# Altium schematic sheet P02_BLOCK DIAGRAM_POWER TREE.SchDoc
size 420 x 297 mm
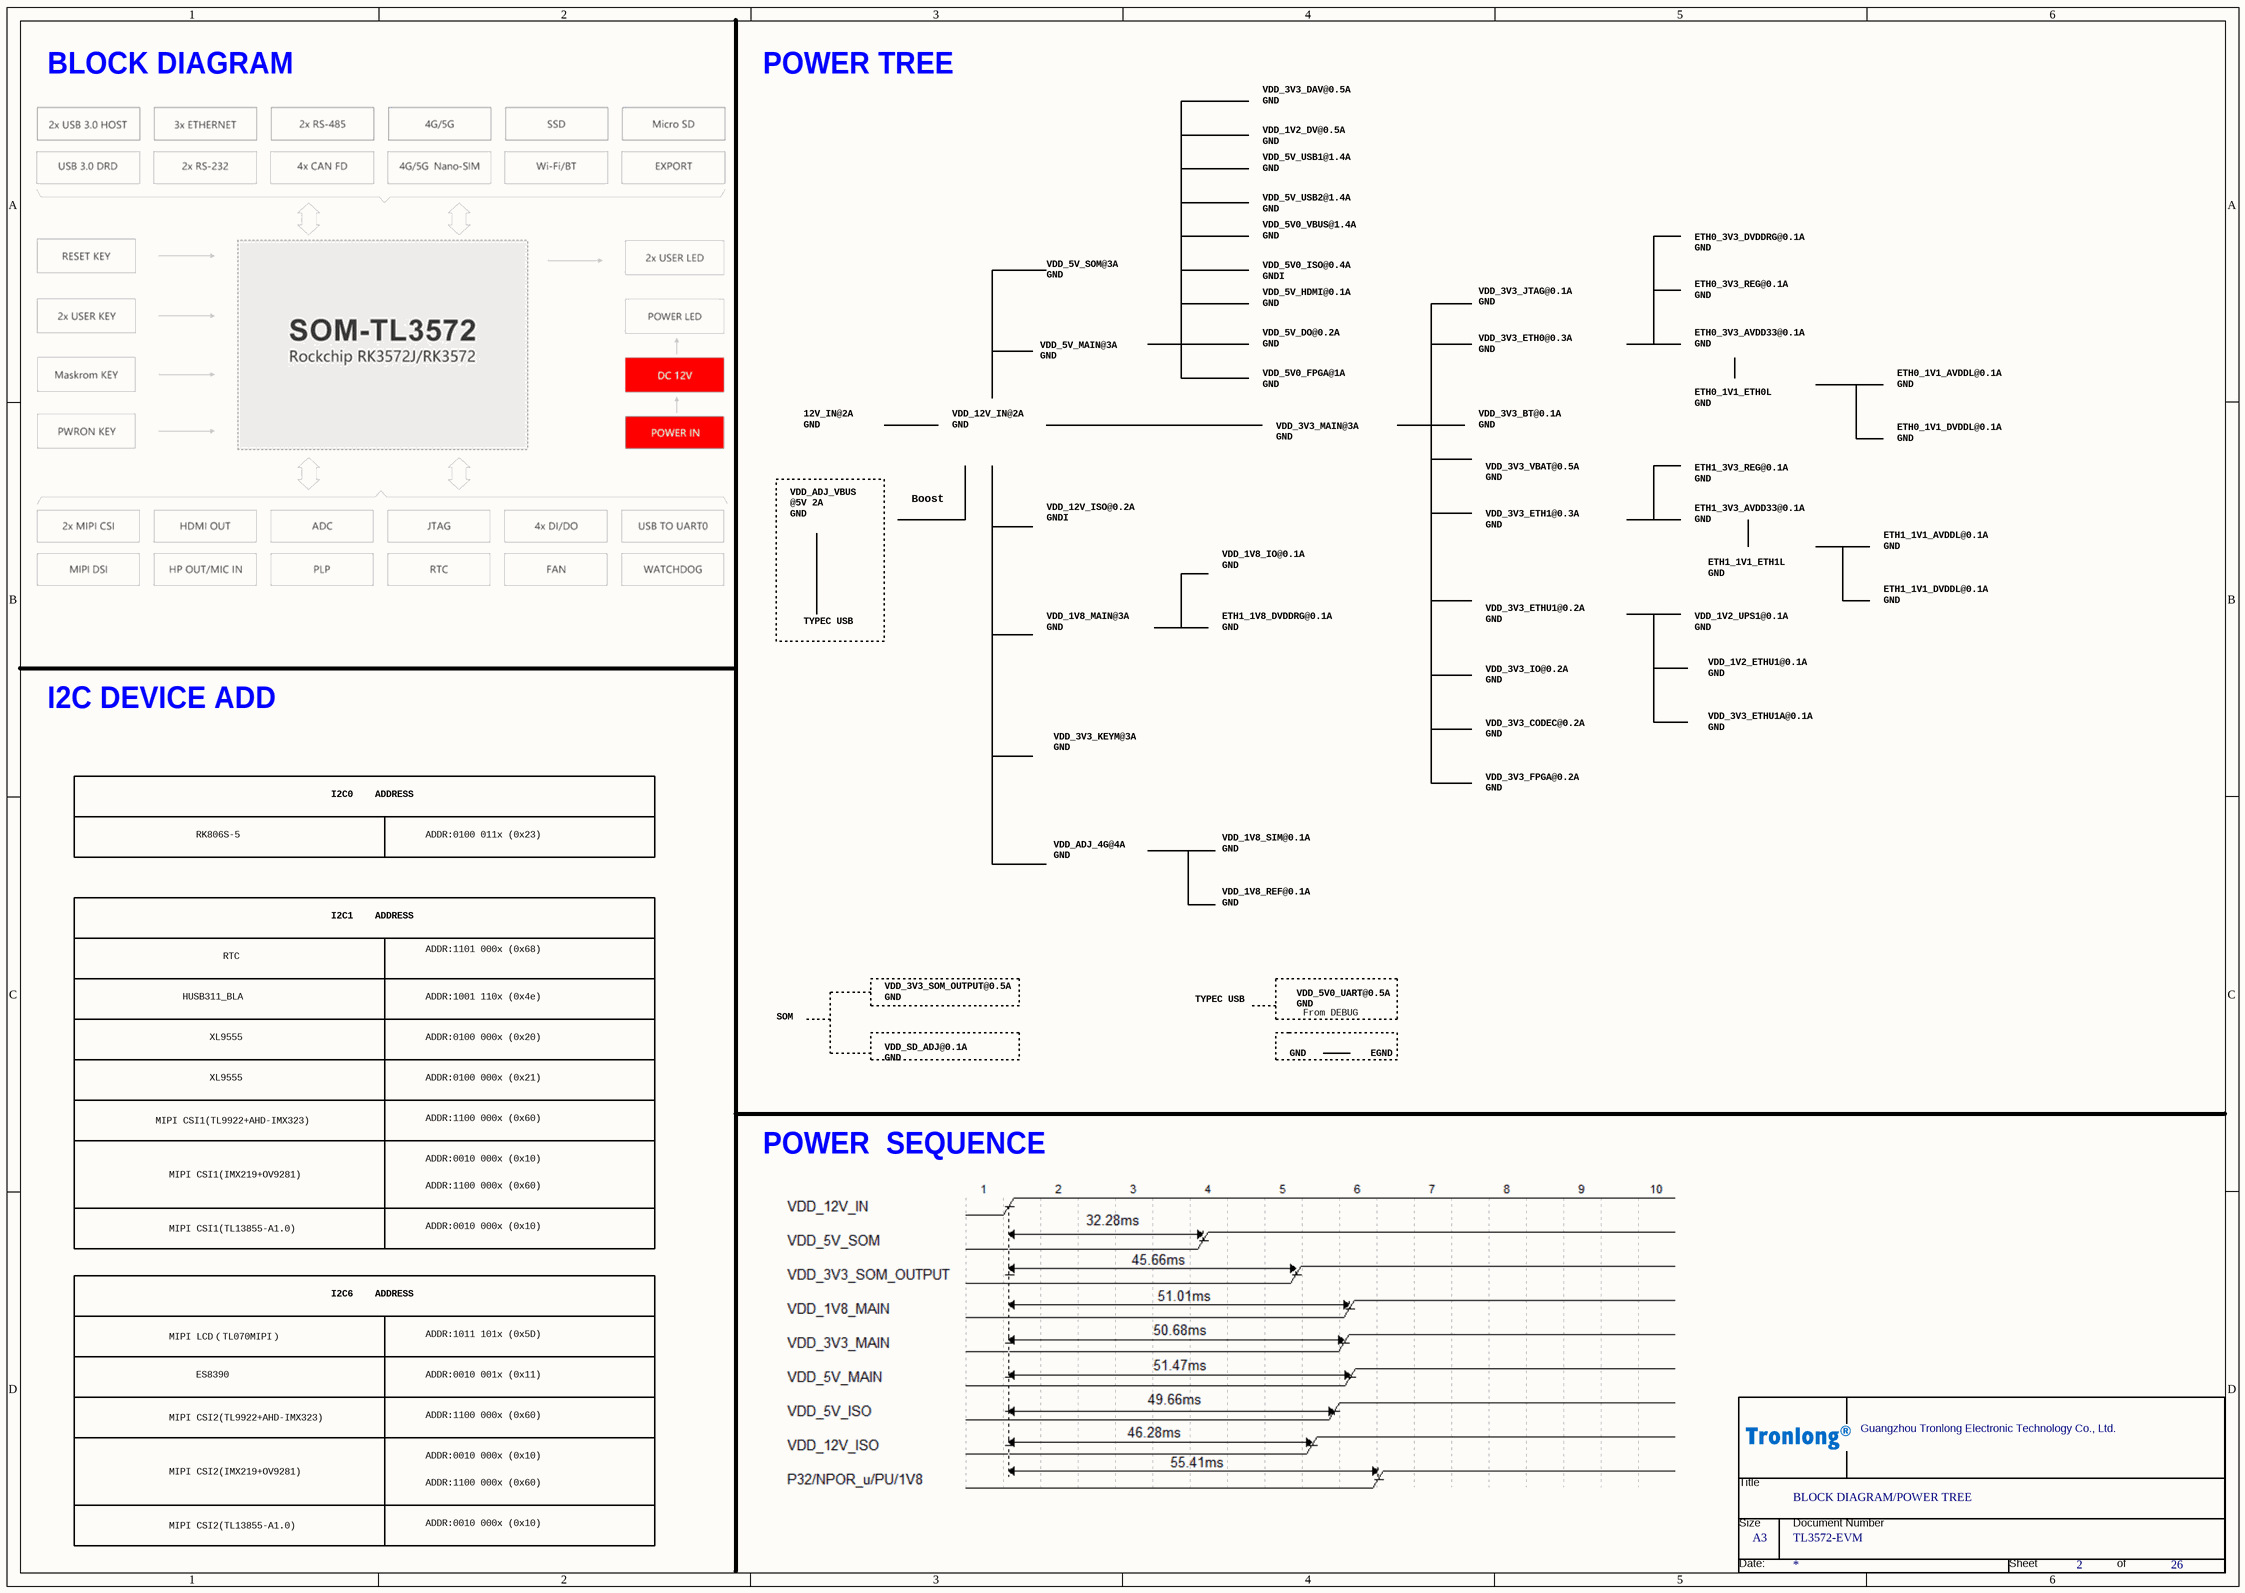
[diagram p0: P02_BLOCK DIAGRAM_POWER TREE.SchDoc]

## Parts
*  Page Count: 26  Page Number: 2  Page Size: A3  OrgName: Guangzhou Tronlong Electronic Technology Co., Ltd.  Title: BLOCK DIAGRAM/POWER TREE  Doc: TL3572-EVM  (hidden comment: TL_NEW)  (graphical)

## Notes on the sheet
- BLOCK DIAGRAM
- POWER TREE
- VDD_3V3_DAV@0.5A
  GND
- VDD_1V2_DV@0.5A
  GND
- VDD_5V_USB1@1.4A
  GND
- VDD_5V0_VBUS@1.4A
  GND
- VDD_5V_USB2@1.4A
  GND
- ETH0_3V3_DVDDRG@0.1A
  GND
- VDD_5V_SOM@3A
  GND
- VDD_5V0_ISO@0.4A
  GNDI
- VDD_5V_HDMI@0.1A
  GND
- VDD_3V3_JTAG@0.1A
  GND
- ETH0_3V3_REG@0.1A
  GND
- VDD_5V_MAIN@3A
  GND
- VDD_5V_DO@0.2A
  GND
- VDD_5V0_FPGA@1A
  GND
- VDD_3V3_ETH0@0.3A
  GND
- ETH0_3V3_AVDD33@0.1A
  GND
- ETH0_1V1_AVDDL@0.1A
  GND
- 12V_IN@2A
  GND
- VDD_12V_IN@2A
  GND
- VDD_3V3_MAIN@3A
  GND
- VDD_3V3_BT@0.1A
  GND
- ETH0_1V1_ETH0L
  GND
- ETH0_1V1_DVDDL@0.1A
  GND
- VDD_ADJ_VBUS
  @5V 2A
  GND
- Boost
- VDD_12V_ISO@0.2A
  GNDI
- VDD_3V3_ETH1@0.3A
  GND
- VDD_3V3_VBAT@0.5A
  GND
- ETH1_3V3_REG@0.1A
  GND
- ETH1_3V3_AVDD33@0.1A
  GND
- VDD_1V8_IO@0.1A
  GND
- ETH1_1V1_ETH1L
  GND
- ETH1_1V1_AVDDL@0.1A
  GND
- TYPEC USB
- VDD_1V8_MAIN@3A
  GND
- ETH1_1V8_DVDDRG@0.1A
  GND
- VDD_3V3_ETHU1@0.2A
  GND
- VDD_1V2_UPS1@0.1A
  GND
- ETH1_1V1_DVDDL@0.1A
  GND
- I2C DEVICE ADD
- VDD_3V3_IO@0.2A
  GND
- VDD_1V2_ETHU1@0.1A
  GND
- VDD_3V3_ETHU1A@0.1A
  GND
- I2C0    ADDRESS
- VDD_3V3_KEYM@3A
  GND
- VDD_3V3_FPGA@0.2A
  GND
- VDD_3V3_CODEC@0.2A
  GND
- RK806S-5
- ADDR:0100 011x (0x23)
- VDD_ADJ_4G@4A
  GND
- VDD_1V8_SIM@0.1A
  GND
- I2C1    ADDRESS
- VDD_1V8_REF@0.1A
  GND
- HUSB311_BLA
- RTC
- ADDR:1101 000x (0x68)
- ADDR:1001 110x (0x4e)
- VDD_3V3_SOM_OUTPUT@0.5A
  GND
- XL9555
- ADDR:0100 000x (0x20)
- SOM
- VDD_SD_ADJ@0.1A
  GND
- GND
- VDD_5V0_UART@0.5A
  GND
- From DEBUG
- EGND
- MIPI CSI1(TL9922+AHD-IMX323)
- ADDR:1100 000x (0x60)
- ADDR:0100 000x (0x21)
- MIPI CSI1(IMX219+OV9281)
- ADDR:0010 000x (0x10)
- POWER  SEQUENCE
- MIPI CSI1(TL13855-A1.0)
- MIPI LCD（TL070MIPI）
- I2C6    ADDRESS
- ADDR:1011 101x (0x5D)
- ES8390
- ADDR:0010 001x (0x11)
- MIPI CSI2(IMX219+OV9281)
- MIPI CSI2(TL9922+AHD-IMX323)
- MIPI CSI2(TL13855-A1.0)
- (in symbol TL_NEW) Title; Size; Document Number; Date:; Sheet; of

## Library data of the parts
* = TL_NEW: RevCode: A?; Page Create Date: March  8, 1995; Page Modify Date: *; Document: TL3572-EVM